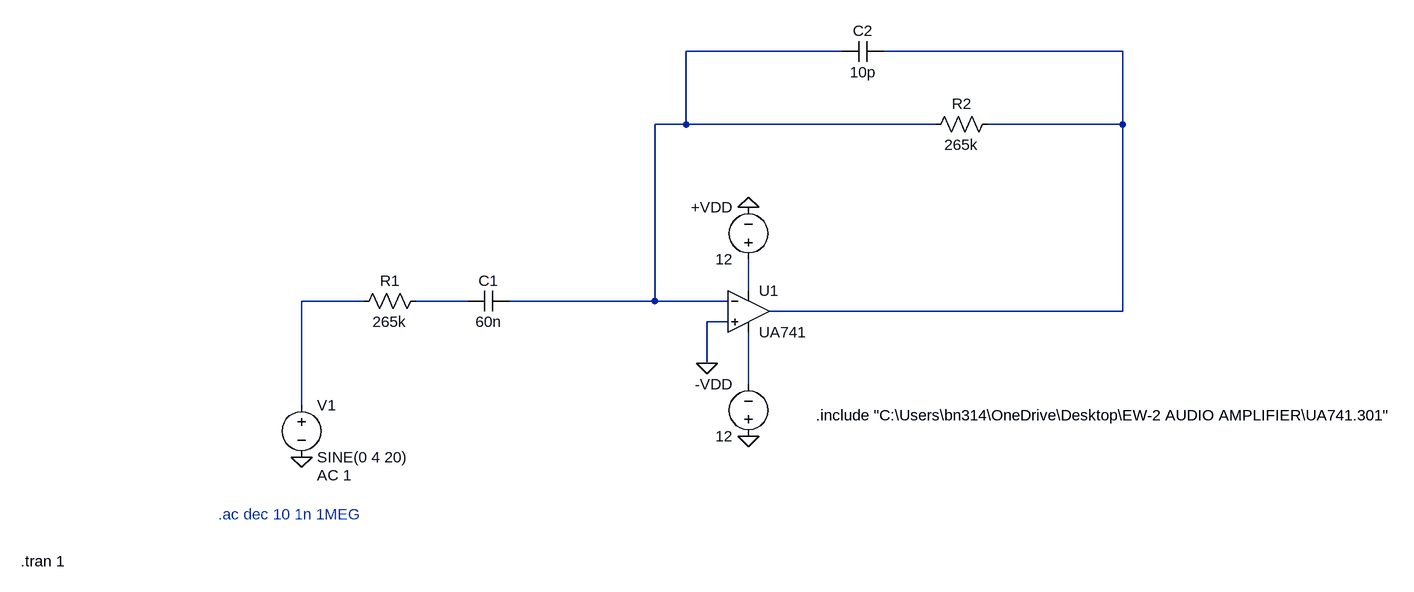
[diagram p0: schematic Filter.asc]
Filter.asc, the LTspice schematic file:
Version 4
SHEET 1 1564 680
WIRE 128 -320 -112 -320
WIRE 560 -320 192 -320
WIRE -112 -208 -112 -320
WIRE -112 -208 -160 -208
WIRE 272 -208 -112 -208
WIRE 560 -208 560 -320
WIRE 560 -208 352 -208
WIRE -16 48 -16 0
WIRE -608 64 -704 64
WIRE -448 64 -528 64
WIRE -160 64 -160 -208
WIRE -160 64 -384 64
WIRE -48 64 -160 64
WIRE 560 80 560 -208
WIRE 560 80 16 80
WIRE -48 96 -80 96
WIRE -80 160 -80 96
WIRE -16 192 -16 112
WIRE -704 224 -704 64
FLAG -704 304 0
FLAG -80 160 0
FLAG -16 -80 0
FLAG -16 272 0
SYMBOL res 368 -224 R90
WINDOW 0 0 56 VBottom 2
WINDOW 3 32 56 VTop 2
SYMATTR InstName R2
SYMATTR Value 265k
SYMBOL cap -384 48 R90
WINDOW 0 0 32 VBottom 2
WINDOW 3 32 32 VTop 2
SYMATTR InstName C1
SYMATTR Value 60n
SYMBOL cap 192 -336 R90
WINDOW 0 0 32 VBottom 2
WINDOW 3 32 32 VTop 2
SYMATTR InstName C2
SYMATTR Value 10p
SYMBOL res -512 48 R90
WINDOW 0 0 56 VBottom 2
WINDOW 3 32 56 VTop 2
SYMATTR InstName R1
SYMATTR Value 265k
SYMBOL voltage -704 208 R0
WINDOW 123 24 124 Left 2
WINDOW 39 0 0 Left 0
SYMATTR Value2 AC 1
SYMATTR InstName V1
SYMATTR Value SINE(0 4 20)
SYMBOL OpAmps\\opamp2 -16 16 R0
SYMATTR InstName U1
SYMATTR Value UA741
SYMBOL voltage -16 16 R180
WINDOW 0 24 96 Left 2
WINDOW 3 24 16 Left 2
SYMATTR InstName +VDD
SYMATTR Value 12
SYMBOL voltage -16 288 R180
WINDOW 0 24 96 Left 2
WINDOW 3 24 16 Left 2
WINDOW 123 0 0 Left 0
WINDOW 39 0 0 Left 0
SYMATTR InstName -VDD
SYMATTR Value 12
TEXT -832 392 Left 2 ;.ac dec 10 1n 1MEG
TEXT 88 240 Left 2 !.include "C:\\Users\\bn314\\OneDrive\\Desktop\\EW-2 AUDIO AMPLIFIER\\UA741.301"
TEXT -1136 464 Left 2 !.tran 1

The netlist it stands for:
* Filter.asc
R2 N002 N001 265k
C1 N001 N005 60n
C2 N002 N001 10p
R1 N005 N004 265k
V1 N004 0 SINE(0 4 20) AC 1
XU1 0 N001 N003 N006 N002 UA741  ; pins In+ In- V+ V- OUT
V§+VDD N003 0 12
V§-VDD 0 N006 12
* .ac dec 10 1n 1MEG
.include "C:\Users\bn314\OneDrive\Desktop\EW-2 AUDIO AMPLIFIER\UA741.301"
.tran 1
.backanno
.end